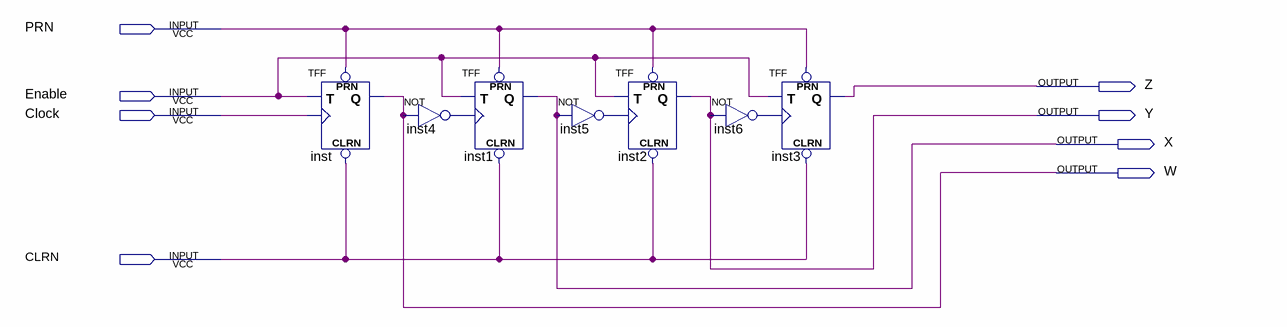
[diagram p0: schematic sheet]
// Quartus schematic lab10step3a.bdf as structural Verilog: 7 symbols, 8 pins
module lab10step3a (
  input  PRN,
  input  Enable,
  input  Clock,
  input  CLRN,
  output Z,
  output Y,
  output X,
  output W
);

  wire inst4_out, inst5_out, inst6_out;

  TFF inst (.PRN(PRN), .CLRN(CLRN), .T(Enable), .CLK(Clock), .Q(W));
  not inst4 (inst4_out, W);
  TFF inst1 (.PRN(PRN), .CLRN(CLRN), .T(Enable), .CLK(inst4_out), .Q(X));
  not inst5 (inst5_out, X);
  TFF inst2 (.PRN(PRN), .CLRN(CLRN), .T(Enable), .CLK(inst5_out), .Q(Y));
  not inst6 (inst6_out, Y);
  TFF inst3 (.PRN(PRN), .CLRN(CLRN), .T(Enable), .CLK(inst6_out), .Q(Z));
endmodule
